# Altium schematic sheet EPS_Connectors_PC-104.SchDoc: Connectors / PC-104
size A4; CheckedBy: (not checked); SheetNumber: 2; SheetTotal: 51
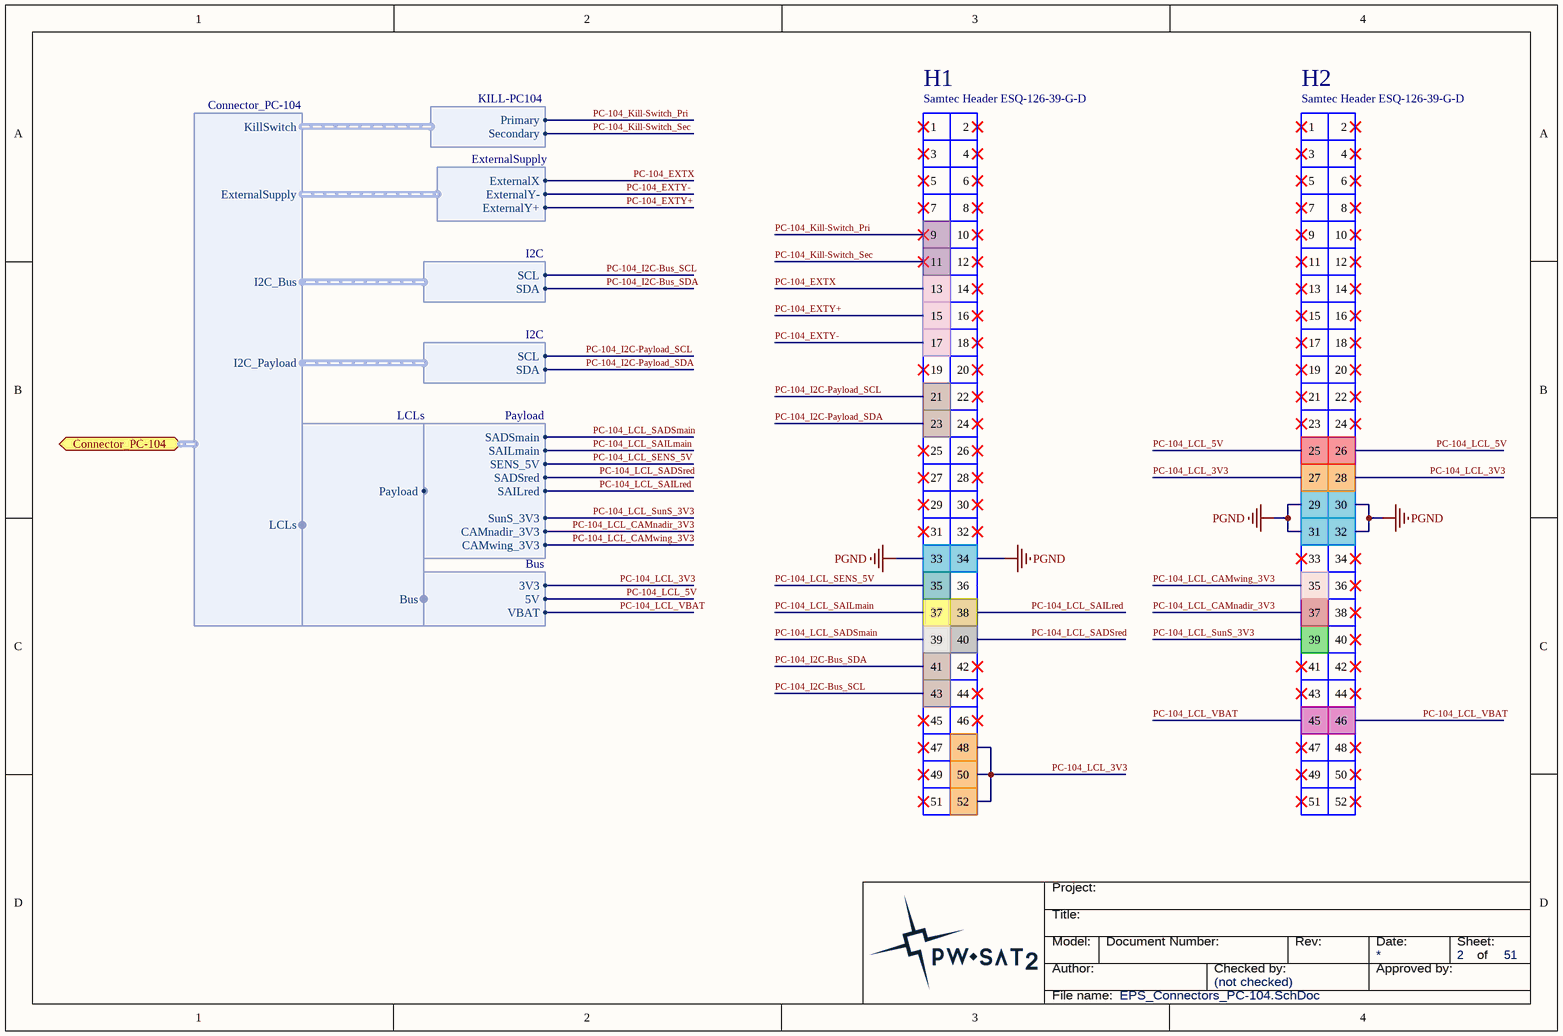
[diagram p0: EPS_Connectors_PC-104.SchDoc]

## Parts
H1  Samtec Header ESQ-126-39-G-D  [Samtec_ESQ-126-39-G-D]
H2  Samtec Header ESQ-126-39-G-D  [Samtec_ESQ-126-39-G-D]

## Ports
Connector_PC-104 (harness Connector_PC-104)

## Harnesses
Connector_PC-104: I2C_Payload, LCLs, I2C_Bus, ExternalSupply, KillSwitch
Payload: SADSred, SAILred, SENS_5V, SAILmain, SADSmain, SunS_3V3, CAMnadir_3V3, CAMwing_3V3
I2C: SDA, SCL
LCLs: Payload, Bus
Bus: 3V3, 5V, VBAT
ExternalSupply: ExternalX, ExternalY-, ExternalY+
KILL-PC104: Secondary, Primary

## Nets
PGND: H1.33 H1.34 H2.29 H2.30 H2.31 H2.32
PC-104_EXTX: H1.13 ; harness ExternalSupply.ExternalX
PC-104_EXTY+: H1.15 ; harness ExternalSupply.ExternalY+
PC-104_EXTY-: H1.17 ; harness ExternalSupply.ExternalY-
PC-104_I2C-Bus_SCL: H1.43 ; harness I2C.SCL
PC-104_I2C-Bus_SDA: H1.41 ; harness I2C.SDA
PC-104_I2C-Payload_SCL: H1.21 ; harness I2C.SCL
PC-104_I2C-Payload_SDA: H1.23 ; harness I2C.SDA
PC-104_Kill-Switch_Pri: H1.9 ; harness KILL-PC104.Primary
PC-104_Kill-Switch_Sec: H1.11 ; harness KILL-PC104.Secondary
PC-104_LCL_3V3: H1.48 H1.50 H1.52 H2.27 H2.28 ; harness Bus.3V3
PC-104_LCL_5V: H2.25 H2.26 ; harness Bus.5V
PC-104_LCL_CAMnadir_3V3: H2.37 ; harness Payload.CAMnadir_3V3
PC-104_LCL_CAMwing_3V3: H2.35 ; harness Payload.CAMwing_3V3
PC-104_LCL_SADSmain: H1.39 ; harness Payload.SADSmain
PC-104_LCL_SADSred: H1.40 ; harness Payload.SADSred
PC-104_LCL_SAILmain: H1.37 ; harness Payload.SAILmain
PC-104_LCL_SAILred: H1.38 ; harness Payload.SAILred
PC-104_LCL_SENS_5V: H1.35 ; harness Payload.SENS_5V
PC-104_LCL_SunS_3V3: H2.39 ; harness Payload.SunS_3V3
PC-104_LCL_VBAT: H2.45 H2.46 ; harness Bus.VBAT

Not connected (* = marked no-connect by the designer): H1 1* 2* 3* 4* 5* 6* 7* 8* 10* 12* 14* 16* 18* 19* 20* 22* 24* 25* 26* 27* 28* 29* 30* 31* 32* 36 42* 44* 45* 46* 47* 49* 51*; H2 1* 2* 3* 4* 5* 6* 7* 8* 9* 10* 11* 12* 13* 14* 15* 16* 17* 18* 19* 20* 21* 22* 23* 24* 33* 34* 36* 38* 40* 41* 42* 43* 44* 47* 48* 49* 50* 51* 52*

## Notes on the sheet
- Title:
- Project:
- Author:
- Model:
- Document Number:
- Checked by:
- Rev:
- Date:
- Approved by:
- Sheet:
- of
- File name:

## Library data of the parts
H1 H2 = Samtec_ESQ-126-xx-x-D: Samtec ESQ Series Header , 2.54mm pitch, 2x26pin. PC-104 Stack Connector.; HelpUrl: http://suddendocs.samtec.com/catalog_english/esq_th.pdf; Value: Samtec Header ESQ-126-39-G-D